# EAGLE schematic training_board (EAGLE 9.6.2)
AUTHOR: Varun Madabushi; REVISION: 0.1; SCH_DESC: Arduino Motor Shield for 2019-20 Training; TEAM: Electrical Training
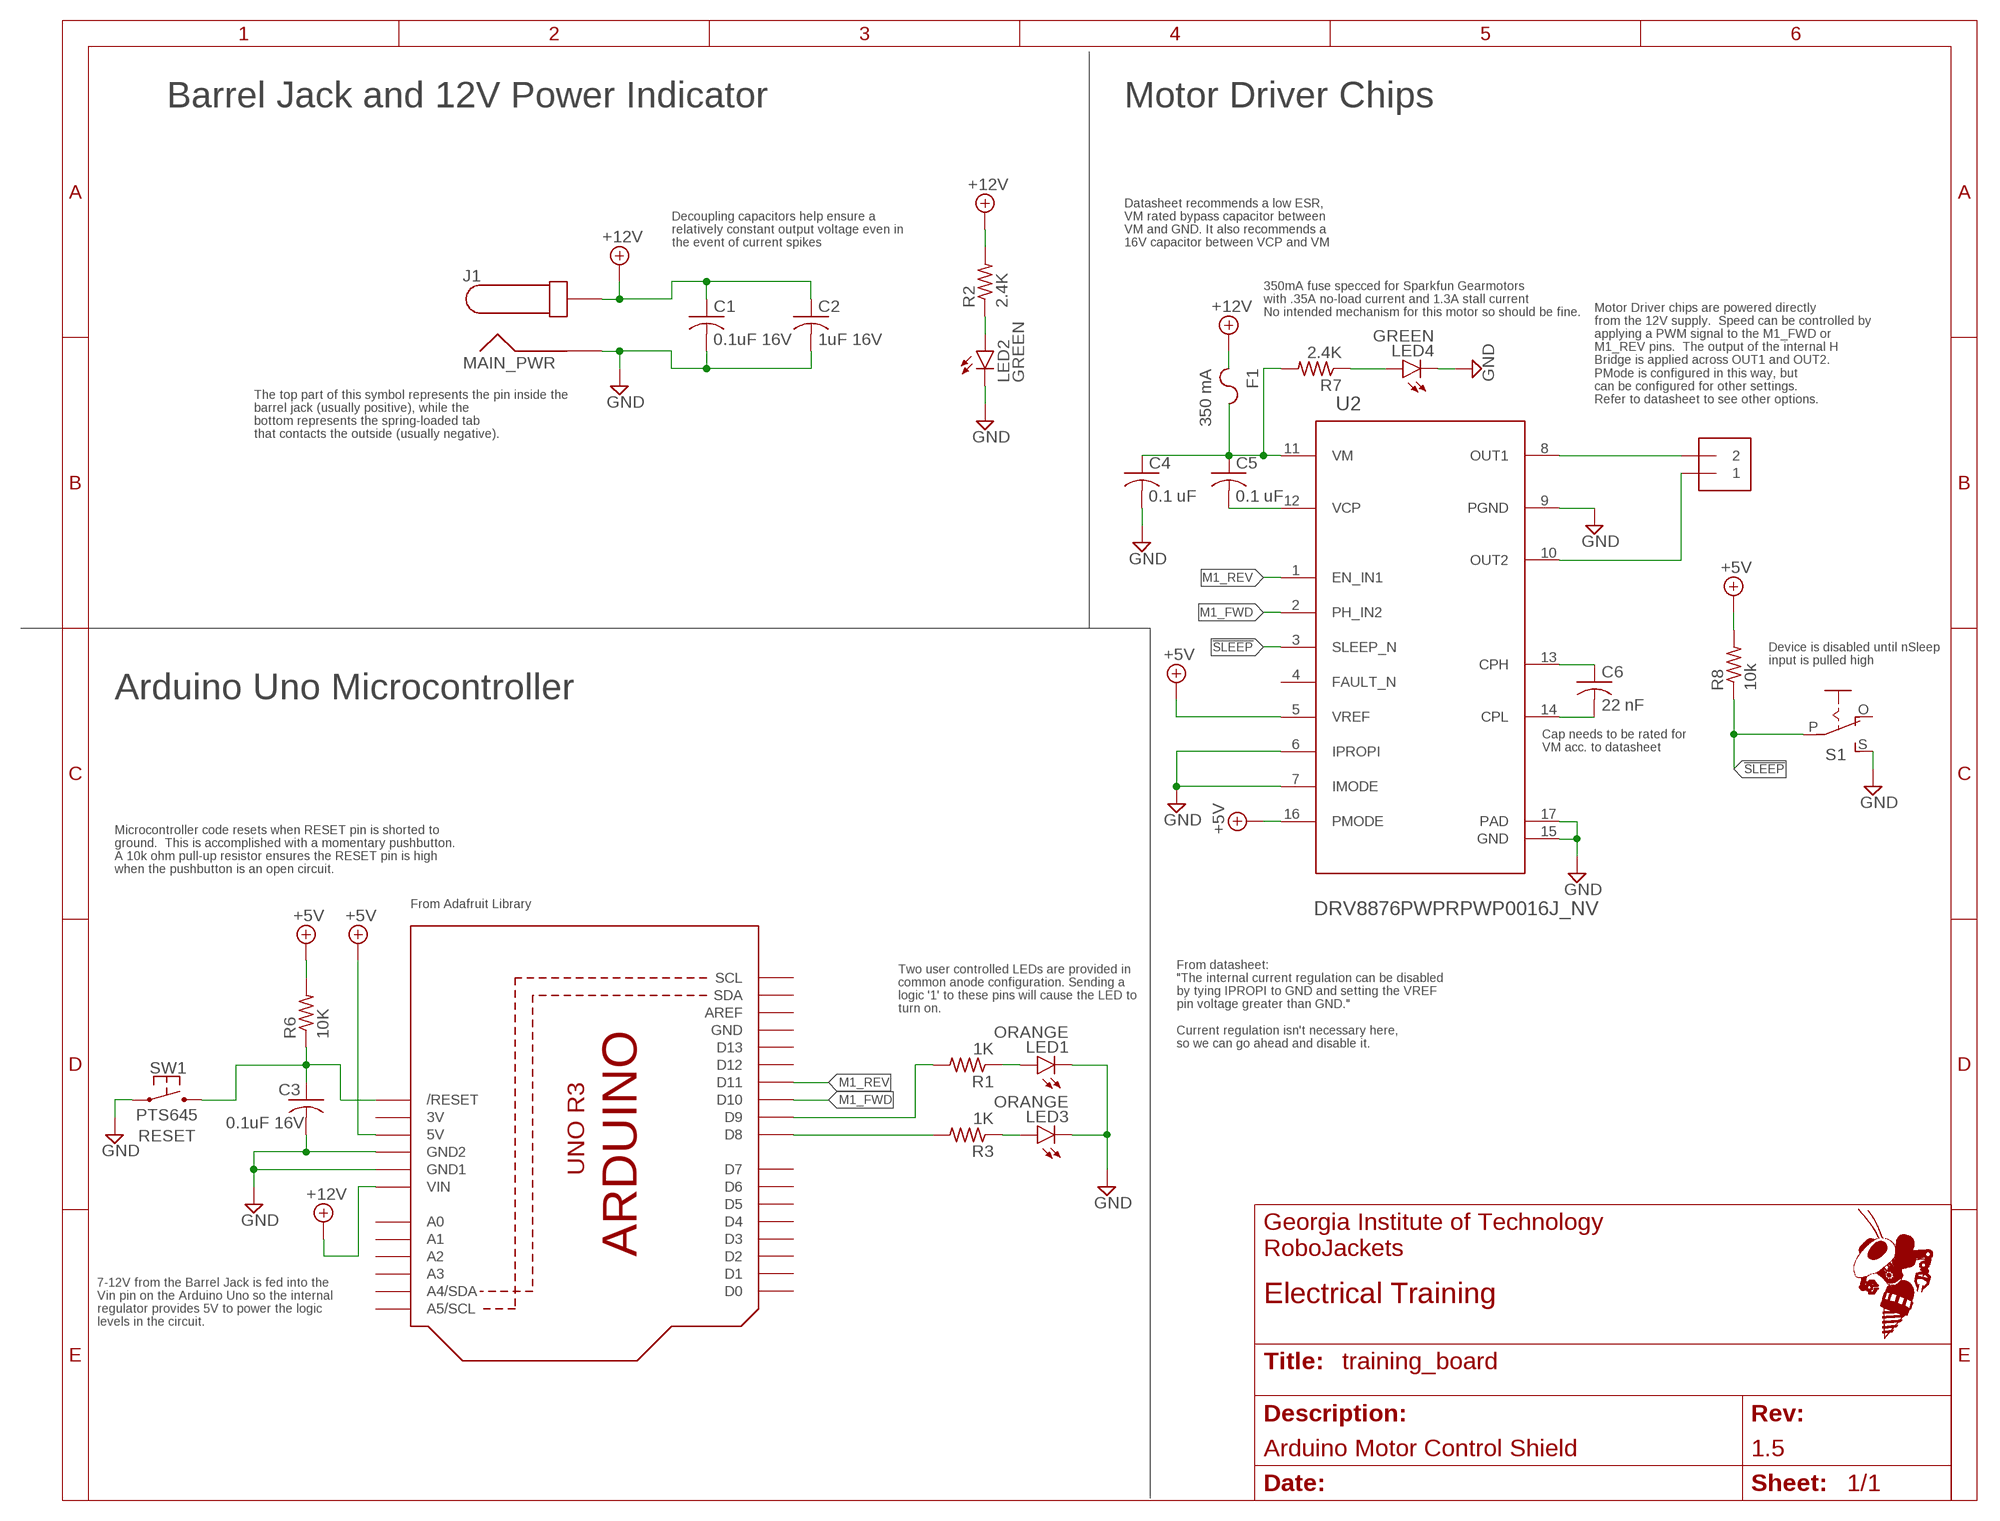
[diagram p0: schematic, sheet 1]
FRAME1 (FRAME_A_L): AUTHOR: Varun Madabushi; REVISION: 1.5; SCH_DESC: Arduino Motor Control Shield; TEAM: Electrical Training

## Parts
C1  0.1uF 16V  C-USC0805  [C0805]
C2  1uF 16V  C-USC0805  [C0805]
C3  0.1uF 16V  C-USC0805  [C0805]
C4  0.1 uF  C-US_CHIP-0603(1608-METRIC)  [CAPC1608X85]
C5  0.1 uF  C-US_CHIP-0603(1608-METRIC)  [CAPC1608X85]
C6  22 nF  C-US_CHIP-0603(1608-METRIC)  [CAPC1608X85]
F1  350 mA  CHIP_FUSE1812  [F1812]
J1  MAIN_PWR  PJ-037A  [PJ-037A]
LED1  ORANGE  LEDCHIP-LED0603  [CHIP-LED0603]
LED2  GREEN  LEDCHIP-LED0603  [CHIP-LED0603]
LED3  ORANGE  LEDCHIP-LED0603  [CHIP-LED0603]
LED4  GREEN  LEDCHIP-LED0603  [CHIP-LED0603]
OUT  1X2-3.5MM  [1X2-3.5MM]
Q2  ARDUINOR3-NOIOREF-NOTEXT  [ARDUINOR3-NOTEXT-NOIOREF]
R1  1K  R-US_R0603  [R0603]
R2  2.4K  R-US_R0603  [R0603]
R3  1K  R-US_R0603  [R0603]
R6  10K  R-US_R0603  [R0603]
R7  2.4K  R-US_R0603  [R0603]
R8  10k  R-US_R0603  [R0603]
S1  EG1903-ND  EG1218S  [EG1218]
SW1  PTS645  [PTS645]
U2  DRV8876PWPRPWP0016J_NV  [PWP0016J_NV]

## Nets
!SLEEP!: R8.1 S1.P U2.3(SLEEP_N)
+5V: Q2.5V R6.2 R8.2 U2.5(VREF) U2.16(PMODE)
+12V: C1.1 C2.1 F1.1 J1.P$2 Q2.VIN R2.2
CPH: C6.1 U2.13(CPH)
CPL: C6.2 U2.14(CPL)
GND: C1.2 C2.2 C3.2 C4.2 J1.P$1 LED1.C LED2.C LED3.C LED4.C Q2.GND1 Q2.GND2 S1.S SW1.1 SW1.2 U2.6(IPROPI) U2.7(IMODE) U2.9(PGND) U2.15(GND) U2.17(PAD)
M1_FWD: Q2.D10 U2.2(PH_IN2)
M1_REV: Q2.D11 U2.1(EN_IN1)
N$8: LED4.A R7.1
N$10: Q2.D9 R1.2
N$11: Q2.D8 R3.2
N$14: LED1.A R1.1
N$15: LED3.A R3.1
N$16: LED2.A R2.1
OUT1: OUT.2 U2.8(OUT1)
OUT2: OUT.1 U2.10(OUT2)
RESET: C3.1 Q2.RESET(/RESET) R6.1 SW1.3 SW1.4
VCP: C5.2 U2.12(VCP)
VM: C4.1 C5.1 F1.2 R7.2 U2.11(VM)
Unconnected: Q2.A0 Q2.A1 Q2.A2 Q2.A3 Q2.A4(A4/SDA) Q2.A5(A5/SCL) Q2.AREF Q2.D0 Q2.D1 Q2.D2 Q2.D3 Q2.D4 Q2.D5 Q2.D6 Q2.D7 Q2.D12 Q2.D13 Q2.SCL Q2.SDA S1.O U2.4(FAULT_N)

## Notes on the sheet
- Barrel Jack and 12V Power Indicator | Motor Driver Chips
- Decoupling capacitors help ensure a
  relatively constant output voltage even in
  the event of current spikes
- Datasheet recommends a low ESR, 
  VM rated bypass capacitor between
  VM and GND. It also recommends a 
  16V capacitor between VCP and VM
- 350mA fuse specced for Sparkfun Gearmotors
  with .35A no-load current and 1.3A stall current
  No intended mechanism for this motor so should be fine.
- Motor Driver chips are powered directly
  from the 12V supply.  Speed can be controlled by
  applying a PWM signal to the M1_FWD or
  M1_REV pins.  The output of the internal H
  Bridge is applied across OUT1 and OUT2.
  PMode is configured in this way, but
  can be configured for other settings.
  Refer to datasheet to see other options.
- The top part of this symbol represents the pin inside the 
  barrel jack (usually positive), while the
  bottom represents the spring-loaded tab
  that contacts the outside (usually negative).
- Device is disabled until nSleep
  input is pulled high
- Arduino Uno Microcontroller
- Cap needs to be rated for
  VM acc. to datasheet
- Microcontroller code resets when RESET pin is shorted to
  ground.  This is accomplished with a momentary pushbutton. 
  A 10k ohm pull-up resistor ensures the RESET pin is high
  when the pushbutton is an open circuit.
- From Adafruit Library
- Two user controlled LEDs are provided in 
  common anode configuration. Sending a 
  logic '1' to these pins will cause the LED to
  turn on.
- From datasheet:
  "The internal current regulation can be disabled 
  by tying IPROPI to GND and setting the VREF
  pin voltage greater than GND."
  
  Current regulation isn't necessary here, 
  so we can go ahead and disable it.
- 7-12V from the Barrel Jack is fed into the
  Vin pin on the Arduino Uno so the internal
  regulator provides 5V to power the logic 
  levels in the circuit.

## Power pins joined to a net without a drawn wire
3V: Q2.3V
GND: Q2.GND

## Library data of the parts
C1-C3 = rcl:C-US: CAPACITOR, American symbol; SPICEPREFIX: C
C4-C6 = Capacitor:C-US: Capacitor - ANSI; CATEGORY: Capacitor
F1 = RoboJackets-Fuses:CHIP_FUSE
J1 = RoboJackets-Connectors:PJ-037A
LED1-LED4 = led:LED: LED OSRAM: - CHIPLED LG R971, LG N971, LY N971, LG Q971, LY Q971, LO R971, LY R971 LH N974, LH R974 LS Q976, LO Q976, LY Q976 LO Q996 - Hyper CHIPLED LW Q18S LB Q993, LB Q99A, LB R99A - SideLED LS A670, LO A670, LY A670, LG A670, LP A670 LB A673, LV A673, LT A673, LW A673 LH A674 LY A675 LS A676, LA A676, LO A676, LY A676, LW A676 LS A679, LY A679, LG A679 - Hyper Micro SIDELED® LS Y876, LA Y876, LO Y876, LY Y876 LT Y87S - SmartLED LW L88C, LW L88S LB L89C, LB L89S, LG L890 LS L89K, LO L89K, LY L89K LS L896, LA L896, LO L896, LY L896 - TOPLED LS T670, LO T670, LY T670, LG T670, LP T670 LSG T670, LSP T670, LSY T670, LOP T670, LYG T670 LG T671, LOG T671, LSG T671 LB T673, LV T673, LT T673, LW T673 LH T674 LS T676, LA T676, LO T676, LY T676, LB T676, LH T676, LSB T676, LW T676 LB T67C, LV T67C, LT T67C, LS T67K, LO T67K, LY T67K, LW E67C LS E67B, LA E67B, LO E67B, LY E67B, LB E67C, LV E67C, LT E67C LW T67C LS T679, LY T679, LG T679 LS T770, LO T770, LY T770, LG T770, LP T770 LB T773, LV T773, LT T773, LW T773 LH T774 LS E675, LA E675, LY E675, LS T675 LS T776, LA T776, LO T776, LY T776, LB T776 LHGB T686 LT T68C, LB T68C - Hyper Mini TOPLED® LB M676 - Mini TOPLED Santana® LG M470 LS M47K, LO M47K, LY M47K Source: http://www.osram.convergy.de LUXEON: - LUMILED® LXK2-PW12-R00, LXK2-PW12-S00, LXK2-PW14-U00, LXK2-PW14-V00 LXK2-PM12-R00, LXK2-PM12-S00, LXK2-PM14-U00 LXK2-PE12-Q00, LXK2-PE12-R00, LXK2-PE12-S00, LXK2-PE14-T00, LXK2-PE14-U00 LXK2-PB12-K00, LXK2-PB12-L00, LXK2-PB12-M00, LXK2-PB14-N00, LXK2-PB14-P00, LXK2-PB14-Q00 LXK2-PR12-L00, LXK2-PR12-M00, LXK2-PR14-Q00, LXK2-PR14-R00 LXK2-PD12-Q00, LXK2-PD12-R00, LXK2-PD12-S00 LXK2-PH12-R00, LXK2-PH12-S00 LXK2-PL12-P00, LXK2-PL12-Q00, LXK2-PL12-R00 Source: www.luxeon.com KINGBRIGHT: KA-3528ASYC Source: www.kingbright.com
OUT = adafruit:1X2: 3.5mm Terminal block http://www.ladyada.net/library/pcb/eaglelibrary.html
Q2 = adafruit:ARDUINOR3-NOIOREF
R1-R3 R6-R8 = rcl:R-US_: RESISTOR, American symbol; SPICEPREFIX: R
S1 = adafruit:EG1218: SLIDING SWITCH 0.1" spacing through hole, vertical SPDT slide switch http://www.ladyada.net/library/pcb/eaglelibrary.html
SW1 = RoboJackets-Switches:PTS645; FUNCTION: RESET
U2 = RoboJackets-ICs:DRV8876PWPR; COPYRIGHT: Copyright (C) 2022 Ultra Librarian. All rights reserved.; MANUFACTURER_PART_NUMBER: DRV8876PWPR; MFR_NAME: Texas Instruments; REFDES: RefDes; TYPE: TYPE